# EAGLE design lemidi (EAGLE 7.5.0)
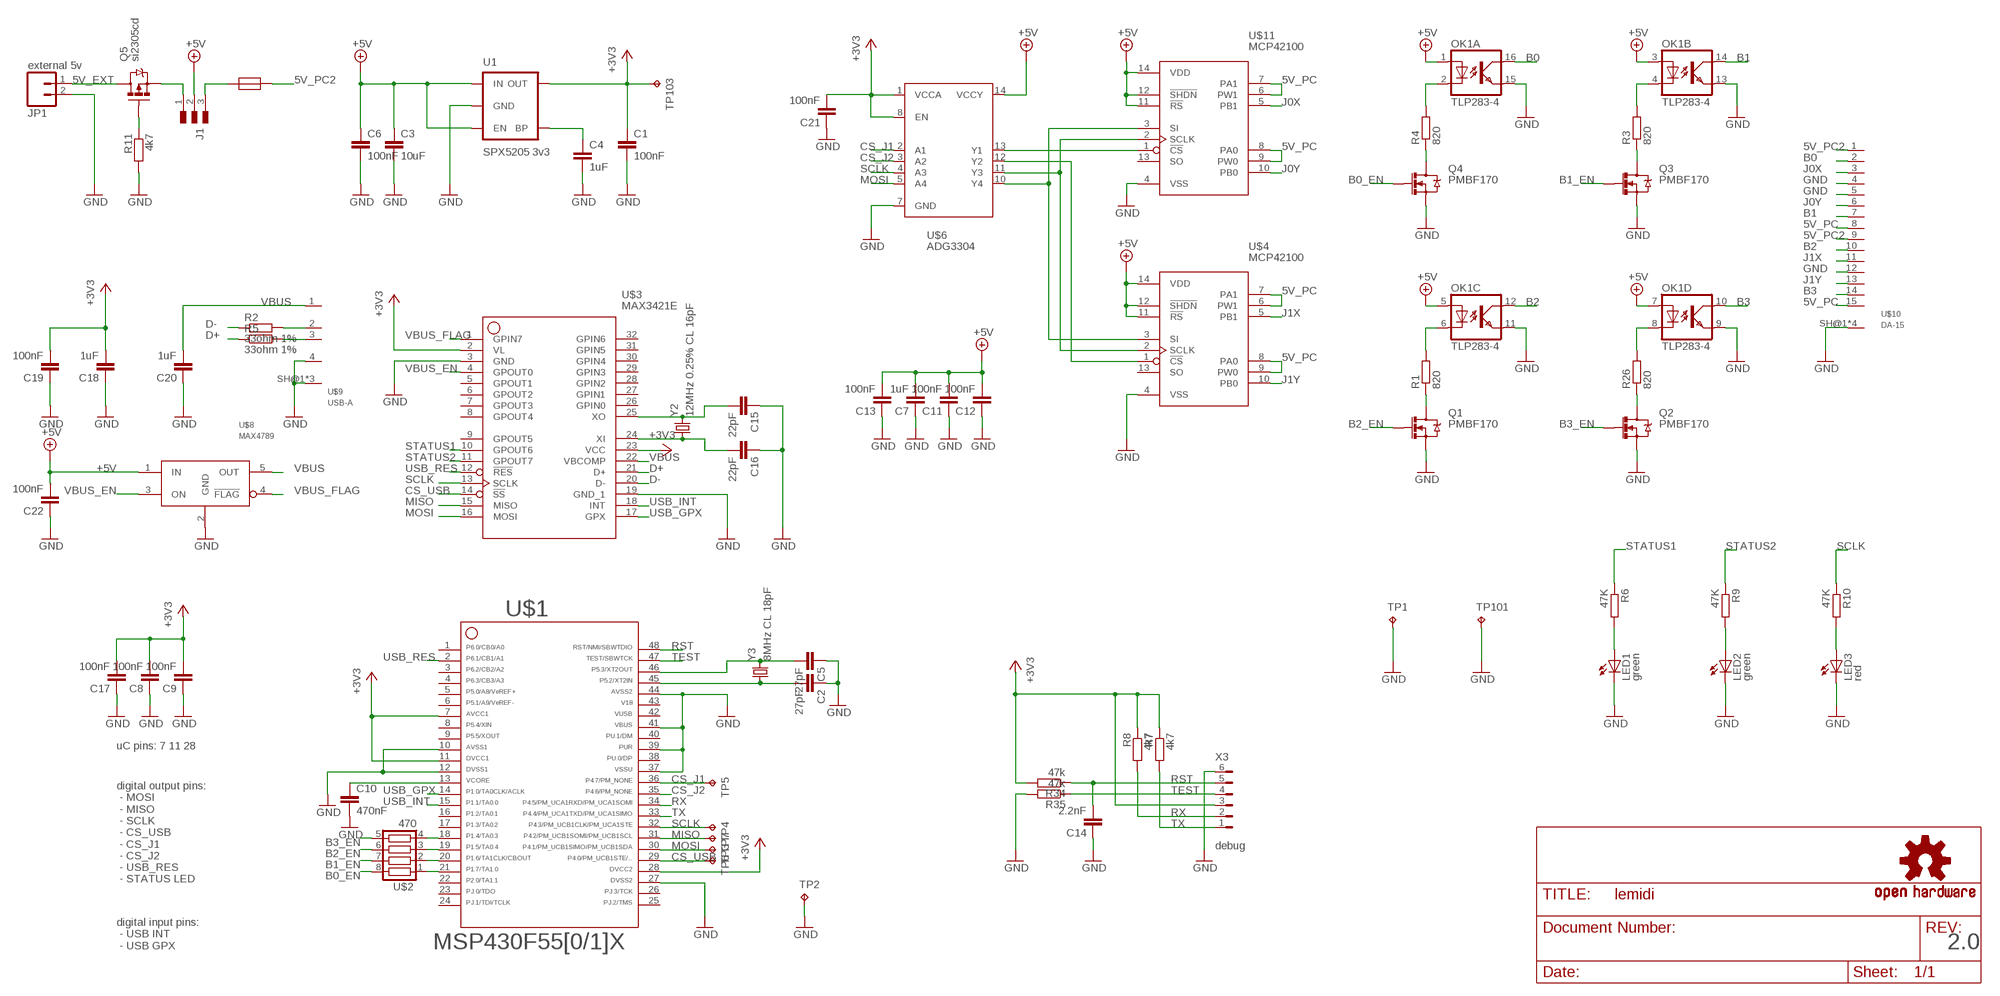
[diagram p0: schematic, sheet 1]

## Parts
C1  100nF  C-EUC0805  [C0805]
C2  27pF  C-EUC0805  [C0805]
C3  10uF  C-EUC0805  [C0805]
C4  1uF  C-EUC0805  [C0805]
C5  27pF  C-EUC0805  [C0805]
C6  100nF  C-EUC0805  [C0805]
C7  1uF  C-EUC0805  [C0805]
C8  100nF  C-EUC0805  [C0805]
C9  100nF  C-EUC0805  [C0805]
C10  470nF  C-EUC0805  [C0805]
C11  100nF  C-EUC0805  [C0805]
C12  100nF  C-EUC0805  [C0805]
C13  100nF  C-EUC0805  [C0805]
C14  2.2nF  C-EUC0805  [C0805]
C15  22pF  C-EUC0805  [C0805]
C16  22pF  C-EUC0805  [C0805]
C17  100nF  C-EUC0805  [C0805]
C18  1uF  C-EUC0805  [C0805]
C19  100nF  C-EUC0805  [C0805]
C20  1uF  C-EUC0805  [C0805]
C21  100nF  C-EUC0805  [C0805]
C22  100nF  C-EUC0805  [C0805]
J1  SJ_3P  [SJ_3P]
JP1  external 5v  M02PTH  [1X02]
LED1  green  LEDCHIPLED_0805  [CHIPLED_0805]
LED2  green  LEDCHIPLED_0805  [CHIPLED_0805]
LED3  red  LEDCHIPLED_0805  [CHIPLED_0805]
OK1  TLP283-4  [MINI-FLAT-16]
Q1  PMBF170  MOSFET-NCHANNEL_SOT23-3  [SOT23-3]
Q2  PMBF170  MOSFET-NCHANNEL_SOT23-3  [SOT23-3]
Q3  PMBF170  MOSFET-NCHANNEL_SOT23-3  [SOT23-3]
Q4  PMBF170  MOSFET-NCHANNEL_SOT23-3  [SOT23-3]
Q5  si2305cd  MOSFET-PCHANNELSMD_POWER  [SOT23-3_POWER]
R1  820  R-EU_R0805W  [R0805W]
R2  33ohm 1%  R-EU_R0805W  [R0805W]
R3  820  R-EU_R0805W  [R0805W]
R4  820  R-EU_R0805W  [R0805W]
R5  33ohm 1%  R-EU_R0805W  [R0805W]
R6  47K  R-EU_R0805W  [R0805W]
R7  4k7  R-EU_R0805W  [R0805W]
R8  4k7  R-EU_R0805W  [R0805W]
R9  47K  R-EU_R0805W  [R0805W]
R10  47K  R-EU_R0805W  [R0805W]
R11  4k7  R-EU_R0805W  [R0805W]
R26  820  R-EU_R0805W  [R0805W]
R34  47k  R-EU_R0805W  [R0805W]
R35  47k  R-EU_R0805W  [R0805W]
TP1  TPTP12R  [TP12R]
TP2  TPTP12R  [TP12R]
TP3  TPTP12R  [TP12R]
TP4  TPTP12R  [TP12R]
TP5  TPTP12R  [TP12R]
TP6  TPTP12R  [TP12R]
TP7  TPTP12R  [TP12R]
TP101  TPTP12R  [TP12R]
TP103  TPTP12R  [TP12R]
U1  SPX5205 3v3  V_REG_LDOSMD  [SOT23-5]
U$1  MSP430F5510  F55[0/1]X---PT48  [PT48]
U$2  470  RES_ARR  [YC164]
U$3  MAX3421E  [TQFP32]
U$4  MCP42100  MCP42XX  [SO-14]
U$6  ADG3304  [TSSOP14]
U$7  OSHW-LOGOM  [OSHW-LOGO-M]
U$8  MAX4789  [SOT23-5]
U$9  USB-A  UBA-4R-D14T-4D  [UBA-4R-D14T-4D]
U$10  DA-15  ADAM_TECH-DSUB_DA-15  [ADAM_TECH_D-SUB_15]
U$11  MCP42100  MCP42XX  [SO-14]
U$12  RESETTABLE_1210  [1210]
X3  debug  MOLEX_6HORIZONTAL  [0530480610]
Y2  12MHz 0.25% CL 16pF  CRYSTAL  [CRYSTAL-SMD-11.4X4.35]
Y3  8MHz CL 18pF  CRYSTAL  [CRYSTAL-SMD-11.4X4.35]

## Nets
5V_EXT: JP1.1 Q5.3(D)
5V_PC: U$4.6(PW1) U$4.7(PA1) U$4.8(PA0) U$4.9(PW0) U$10.8 U$10.15 U$11.6(PW1) U$11.7(PA1) U$11.8(PA0) U$11.9(PW0)
5V_PC2: U$10.1 U$10.9 U$12.P$2
12MHX_XI: C16.2 U$3.24(XI) Y2.1
12MHZ_XO: C15.2 U$3.25(XO) Y2.2
+3V3: C1.1 C8.2 C9.2 C17.2 C18.2 C19.2 C21.2 R7.1 R8.1 R34.2 TP103.TP U1.5(OUT) U$1.7 U$1.11 U$1.28 U$3.2(VL) U$3.23(VCC) U$6.1(VCCA) U$6.8(EN) X3.3
+5V: C3.1 C6.1 C7.2 C11.2 C12.2 C13.2 C22.2 J1.2 OK1.1(A:A) OK1.3(B:A) OK1.5(C:A) OK1.7(D:A) U1.1(IN) U1.3(EN) U$4.11(!RS) U$4.12(!SHDN) U$4.14(VDD) U$6.14(VCCY) U$8.1(IN) U$11.11(!RS) U$11.12(!SHDN) U$11.14(VDD)
B0: OK1.16(A:COL) U$10.2
B0_EN: Q4.1(G) U$2.8
B1: OK1.14(B:COL) U$10.7
B1_EN: Q3.1(G) U$2.7
B2: OK1.12(C:COL) U$10.10
B2_EN: Q1.1(G) U$2.6
B3: OK1.10(D:COL) U$10.14
B3_EN: Q2.1(G) U$2.5
CS_J1: TP5.TP U$1.36 U$6.2(A1)
CS_J2: U$1.35 U$6.3(A2)
CS_USB: TP6.TP U$1.29 U$3.14(!SS)
D+: R5.1 U$3.21(D+)
D-: R2.1 U$3.20(D-)
GND: C1.2 C2.1 C3.2 C4.2 C5.1 C6.2 C7.1 C8.1 C9.1 C10.2 C11.1 C12.1 C13.1 C14.1 C15.1 C16.1 C17.1 C18.1 C19.1 C20.1 C21.1 C22.1 JP1.2 LED1.C LED2.C LED3.C OK1.9(D:EMIT) OK1.11(C:EMIT) OK1.13(B:EMIT) OK1.15(A:EMIT) Q1.2(S) Q2.2(S) Q3.2(S) Q4.2(S) R11.2 R35.2 TP1.TP TP2.TP TP101.TP U1.2(GND) U$1.10 U$1.12 U$1.27 U$1.37 U$1.39 U$1.41 U$1.44 U$3.3(GND) U$3.19(GND_1) U$4.4(VSS) U$6.7(GND) U$8.2(GND) U$9.4 U$9.SH@1(SH) U$9.SH@2(SH) U$9.SH@3(SH) U$10.4 U$10.5 U$10.12 U$10.SH@1(SHIELD) U$10.SH@2(SHIELD) U$10.SH@3(SHIELD) U$10.SH@4(SHIELD) U$11.4(VSS) X3.6
HIGH_CS1: U$6.13(Y1) U$11.1(!CS)
HIGH_CS2: U$4.1(!CS) U$6.12(Y2)
HIGH_MOSI: U$4.3(SI) U$6.10(Y4) U$11.3(SI)
HIGH_SCLK: U$4.2(SCLK) U$6.11(Y3) U$11.2(SCLK)
J0X: U$10.3 U$11.5(PB1)
J0Y: U$10.6 U$11.10(PB0)
J1X: U$4.5(PB1) U$10.11
J1Y: U$4.10(PB0) U$10.13
MISO: TP7.TP U$1.31 U$3.15(MISO)
MOSI: TP3.TP U$1.30 U$3.16(MOSI) U$6.5(A4)
N$1: LED1.A R6.2
N$2: C4.1 U1.4(BP)
N$3: U$1.18 U$2.4
N$4: LED2.A R9.2
N$5: Q1.3(D) R1.1
N$6: C10.1 U$1.13
N$7: OK1.6(C:C) R1.2
N$8: U$1.19 U$2.3
N$9: OK1.8(D:C) R26.2
N$10: J1.3 U$12.P$1
N$11: LED3.A R10.2
N$12: Q3.3(D) R3.1
N$13: OK1.4(B:C) R3.2
N$14: Q4.3(D) R4.1
N$15: OK1.2(A:C) R4.2
N$16: R5.2 U$9.3
N$17: R2.2 U$9.2
N$20: U$1.20 U$2.2
N$21: U$1.21 U$2.1
N$22: Q2.3(D) R26.1
N$23: J1.1 Q5.2(S)
N$24: Q5.1(G) R11.1
RST: C14.2 R34.1 U$1.48 X3.5
RX: R8.2 U$1.34 X3.2
SCLK: R10.1 TP4.TP U$1.32 U$3.13(SCLK) U$6.4(A3)
STATUS1: R6.1 U$3.10(GPOUT6)
STATUS2: R9.1 U$3.11(GPOUT7)
TEST: R35.1 U$1.47 X3.4
TX: R7.2 U$1.33 X3.1
USB_GPX: U$1.14 U$3.17(GPX)
USB_INT: U$1.15 U$3.18(INT)
USB_RES: U$1.2 U$3.12(!RES)
VBUS: C20.2 U$3.22(VBCOMP) U$8.5(OUT) U$9.1
VBUS_EN: U$3.4(GPOUT0) U$8.3(ON)
VBUS_FLAG: U$3.1(GPIN7) U$8.4(!FLAG)
XT2IN: C2.2 U$1.45 Y3.1
XT2OUT: C5.2 U$1.46 Y3.2
Unconnected: U$1.1 U$1.3 U$1.4 U$1.5 U$1.6 U$1.8 U$1.9 U$1.16 U$1.17 U$1.22 U$1.23 U$1.24 U$1.25 U$1.26 U$1.38 U$1.40 U$3.5(GPOUT1) U$3.6(GPOUT2) U$3.7(GPOUT3) U$3.8(GPOUT4) U$3.9(GPOUT5) U$3.26(GPIN0) U$3.27(GPIN1) U$3.28(GPIN2) U$3.29(GPIN3) U$3.30(GPIN4) U$3.31(GPIN5) U$3.32(GPIN6) U$4.13(SO) U$11.13(SO)

## Notes on the sheet
- uC pins: 7 11 28
- digital output pins: 
   - MOSI
   - MISO
   - SCLK
   - CS_USB
   - CS_J1
   - CS_J2
   - USB_RES
   - STATUS LED
- digital input pins:
   - USB INT
   - USB GPX
- 2.0

## Power pins joined to a net without a drawn wire
42: U$1.42
43: U$1.43

## Library data of the parts
C1-C22 = rcl:C-EU: CAPACITOR, European symbol
J1 = Simplex-Jumpers:SJ_3P: solder jumper 3 pin
JP1 = SparkFun-Connectors:M02: Standard 2-pin 0.1" header. Use with - straight break away headers ( PRT-00116) - right angle break away headers (PRT-00553) - swiss pins (PRT-00743) - machine pins (PRT-00117) - female headers (PRT-00115) Molex polarized connector foot print use with: PRT-08233 with associated crimp pins and housings. 2.54_SCREWTERM for use with PRT-10571. 3.5mm Screw Terminal footprints for PRT-08084 5mm Screw Terminal footprints for use with PRT-08432
LED1-LED3 = led:LED: LED OSRAM: - CHIPLED LG R971, LG N971, LY N971, LG Q971, LY Q971, LO R971, LY R971 LH N974, LH R974 LS Q976, LO Q976, LY Q976 LO Q996 - Hyper CHIPLED LW Q18S LB Q993, LB Q99A, LB R99A - SideLED LS A670, LO A670, LY A670, LG A670, LP A670 LB A673, LV A673, LT A673, LW A673 LH A674 LY A675 LS A676, LA A676, LO A676, LY A676, LW A676 LS A679, LY A679, LG A679 - Hyper Micro SIDELED® LS Y876, LA Y876, LO Y876, LY Y876 LT Y87S - SmartLED LW L88C, LW L88S LB L89C, LB L89S, LG L890 LS L89K, LO L89K, LY L89K LS L896, LA L896, LO L896, LY L896 - TOPLED LS T670, LO T670, LY T670, LG T670, LP T670 LSG T670, LSP T670, LSY T670, LOP T670, LYG T670 LG T671, LOG T671, LSG T671 LB T673, LV T673, LT T673, LW T673 LH T674 LS T676, LA T676, LO T676, LY T676, LB T676, LH T676, LSB T676, LW T676 LB T67C, LV T67C, LT T67C, LS T67K, LO T67K, LY T67K, LW E67C LS E67B, LA E67B, LO E67B, LY E67B, LB E67C, LV E67C, LT E67C LW T67C LS T679, LY T679, LG T679 LS T770, LO T770, LY T770, LG T770, LP T770 LB T773, LV T773, LT T773, LW T773 LH T774 LS E675, LA E675, LY E675, LS T675 LS T776, LA T776, LO T776, LY T776, LB T776 LHGB T686 LT T68C, LB T68C - Hyper Mini TOPLED® LB M676 - Mini TOPLED Santana® LG M470 LS M47K, LO M47K, LY M47K Source: http://www.osram.convergy.de LUXEON: - LUMILED® LXK2-PW12-R00, LXK2-PW12-S00, LXK2-PW14-U00, LXK2-PW14-V00 LXK2-PM12-R00, LXK2-PM12-S00, LXK2-PM14-U00 LXK2-PE12-Q00, LXK2-PE12-R00, LXK2-PE12-S00, LXK2-PE14-T00, LXK2-PE14-U00 LXK2-PB12-K00, LXK2-PB12-L00, LXK2-PB12-M00, LXK2-PB14-N00, LXK2-PB14-P00, LXK2-PB14-Q00 LXK2-PR12-L00, LXK2-PR12-M00, LXK2-PR14-Q00, LXK2-PR14-R00 LXK2-PD12-Q00, LXK2-PD12-R00, LXK2-PD12-S00 LXK2-PH12-R00, LXK2-PH12-S00 LXK2-PL12-P00, LXK2-PL12-Q00, LXK2-PL12-R00 Source: www.luxeon.com KINGBRIGHT: KA-3528ASYC Source: www.kingbright.com
OK1 = optocoupler:TLP283-4: TOSHIBA PHOTOCOUPLER GaAs IRED & PHOTO-TRANSISTOR Source: http://www.semicon.toshiba.co.jp/td/en/Opto/Photocoupler/en_20050928_TLP283_datasheet.pdf; OC_FARNELL: unknown; OC_NEWARK: unknown
Q1-Q4 = Simplex-DiscreteSemi:MOSFET-NCHANNEL: Generic N-channel mosfet
Q5 = Simplex-DiscreteSemi:MOSFET-PCHANNEL: Generic PMOSFET
R1-R11 R26 R34 R35 = rcl:R-EU_: RESISTOR, European symbol
TP1-TP7 TP101 TP103 = testpad:TP: Test pad
U1 = SparkFun:V_REG_LDO: Voltage Regulator LDO Standard 150mA LDO voltage regulator in SOT-23 layout. Micrel part MIC5205. BP (by-pass) pin is used to lower output noise with 470pF cap.
U$1 = TI_MSP430_v16:F55[0/1]X---PT48: ***F55[0/1/2]X*** PT48 Rev. 1.0 06/2010 "http://www.ti.com/lit/gpn/msp430f5509" Only for FF5504, F5508,F5509,F5510
U$2 = Simplex-rlc:RES_ARR: resistor chip array yageo YC164 series (8pin/4R)
U$3 = Simplex-ICs:MAX3421E: MAX3421E USB Periperal/Host Controller
U$4 U$11 = Simplex-ICs:MCP42XX: MCP42xx dual digital potentiometer
U$6 = Simplex-ICs:ADG3304: ADG3304 4channel bi-directional voltage level translator
U$7 = SparkFun:OSHW-LOGO: Open Source Hardware Logo This logo indicates the piece of hardware it is found on incorporates a OSHW license and/or adheres to the definition of open source hardware found here: http://freedomdefined.org/OSHW
U$8 = Simplex-ICs:MAX4789: MAX4789 - MAX4794 current limit switch
U$9 = Simplex-Connectors:UBA-4R-D14T-4D: JST USB A
U$10 = Simplex-Connectors:ADAM_TECH-DSUB_DA-15: ADAM TECH D-SUB DA-15
U$12 = Simplex-Fuses:RESETTABLE: resettable fuse
X3 = Simplex-Connectors:MOLEX_6: Molex 6 pin connectors 1.25mm PicoBlade
Y2 Y3 = Simplex-FreqCtrl:CRYSTAL: smd crystals

## Net classes
1 vcc: width 0.203 mm

## Board
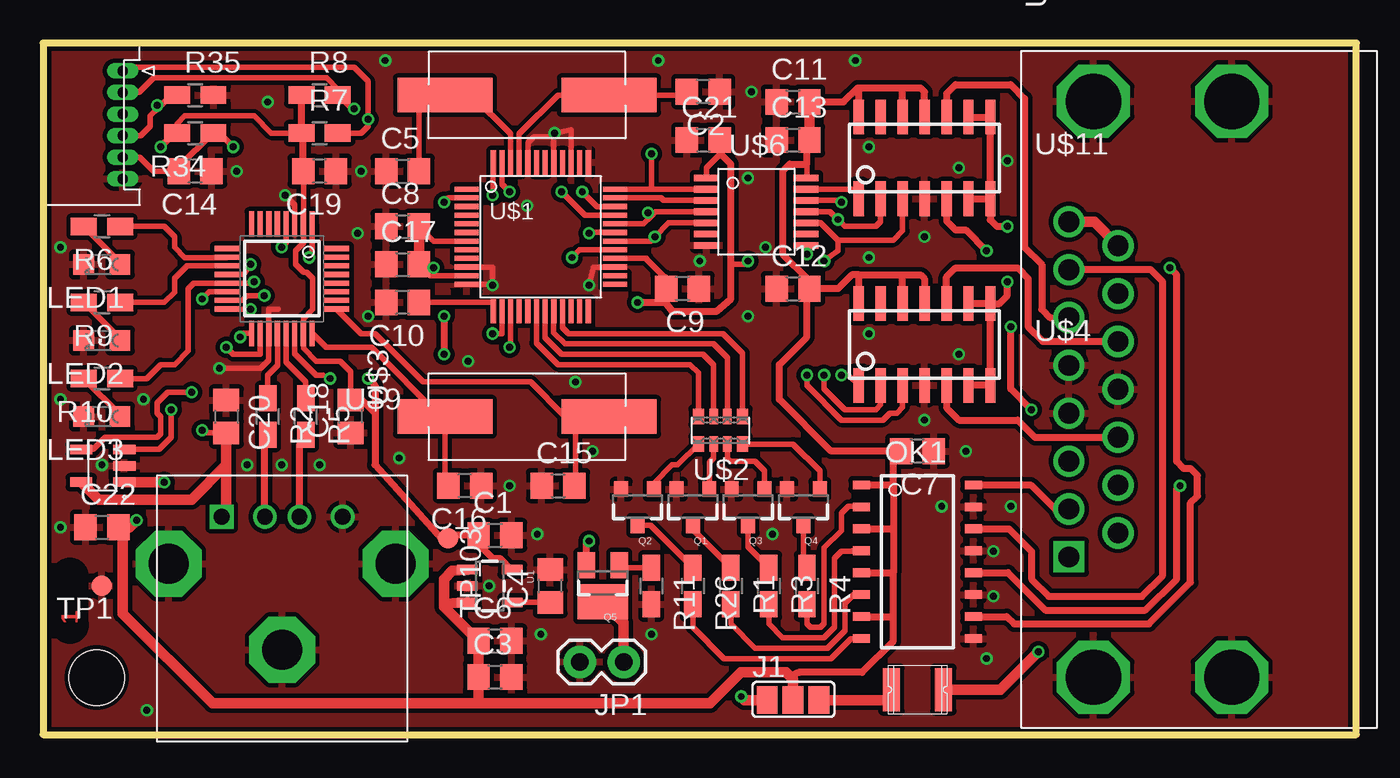
[diagram p1: board, top side]
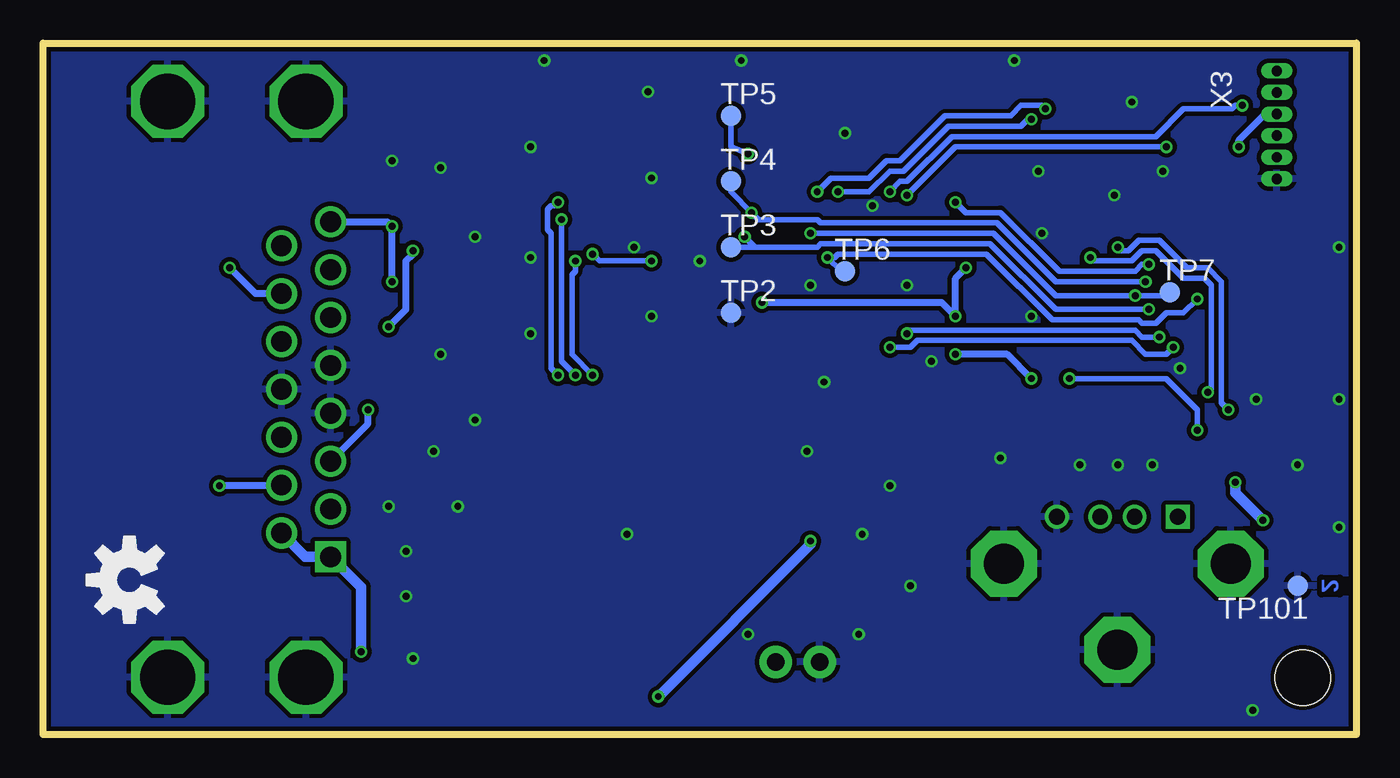
[diagram p2: board, bottom side, seen from below]

Size 76 x 40 mm. Coordinates in mm from the lower left corner, seen from the top.
Outline: 0,0 76,0 76,40 0,40 0,0
Copper layers (1*16): Top 0.035mm / dielectric 1.5mm / Bottom 0.035mm
Design rules "seeed_2-layer_20140221": minimum track width 6mil, minimum drill 12mil, track to track 6mil, track to pad 6mil, pad to pad 6mil, via to via 6mil, smd to smd 0mil, copper to edge 10mil, drill to drill 10mil, minimum pad ring 6mil, minimum via ring 6mil, stop-mask expansion 2mil, vias tented up to drill 100mil, thermal gap 10mil
Holes 3.2 mm at 3.1,3.3
tRestrict: 1 lines

### Footprints (pad centres in the part's own frame; a part is rotated, then mirrored left to right if it is on the bottom)
C0805 = smd 1.3 x 1.5: 1 -0.95,0; 2 0.95,0
SJ_3P = smd 1.2 x 1.6: 1 0,0; 2 1.5,0; 3 3,0
1X02 = drill 1.016 pad 1.88: 1 0,0; 2 2.54,0
CHIPLED_0805 = smd 1.2 x 1.2: A 0,-1.05; C 0,1.05
MINI-FLAT-16 = smd 1 x 0.5: 1 -3.24,4.445; 2 -3.24,3.175; 3 -3.24,1.905; 4 -3.24,0.635; 5 -3.24,-0.635; 6 -3.24,-1.905; 7 -3.24,-3.175; 8 -3.24,-4.445; 9 3.24,-4.445; 10 3.24,-3.175; 11 3.24,-1.905; 12 3.24,-0.635; 13 3.24,0.635; 14 3.24,1.905; 15 3.24,3.175; 16 3.24,4.445
SOT23-3 = smd 0.8 x 0.9: 1 -0.95,-1; 2 0.95,-1; 3 0,1.1
SOT23-3_POWER = smd 1 x 1.5: 1 -0.939,-1.384; 2 0.961,-1.384 | smd 2.9 x 2.05: 3 0.011,0.716
R0805W = smd 1.5 x 1: 1 -1.052,0; 2 1.052,0
TP12R = smd 1.2 x 1.2: TP 0,0
SOT23-5 = smd 0.55 x 1.2: 1 -0.95,-1.3; 2 0,-1.3; 3 0.95,-1.3; 4 0.95,1.3; 5 -0.95,1.3
PT48 = smd 1.4 x 0.3: 1 -4.3,2.75; 2 -4.3,2.25; 3 -4.3,1.75; 4 -4.3,1.25; 5 -4.3,0.75; 6 -4.3,0.25; 7 -4.3,-0.25; 8 -4.3,-0.75; 9 -4.3,-1.25; 10 -4.3,-1.75; 11 -4.3,-2.25; 12 -4.3,-2.75; 25 4.3,-2.75; 26 4.3,-2.25; 27 4.3,-1.75; 28 4.3,-1.25; 29 4.3,-0.75; 30 4.3,-0.25; 31 4.3,0.25; 32 4.3,0.75; 33 4.3,1.25; 34 4.3,1.75; 35 4.3,2.25; 36 4.3,2.75 | smd 0.3 x 1.4: 13 -2.75,-4.3; 14 -2.25,-4.3; 15 -1.75,-4.3; 16 -1.25,-4.3; 17 -0.75,-4.3; 18 -0.25,-4.3; 19 0.25,-4.3; 20 0.75,-4.3; 21 1.25,-4.3; 22 1.75,-4.3; 23 2.25,-4.3; 24 2.75,-4.3; 37 2.75,4.3; 38 2.25,4.3; 39 1.75,4.3; 40 1.25,4.3; 41 0.75,4.3; 42 0.25,4.3; 43 -0.25,4.3; 44 -0.75,4.3; 45 -1.25,4.3; 46 -1.75,4.3; 47 -2.25,4.3; 48 -2.75,4.3
YC164 = smd 0.65 x 0.9: 1 -1.275,-0.8; 4 1.275,-0.8; 5 1.275,0.8; 8 -1.275,0.8 | smd 0.5 x 0.9: 2 -0.4,-0.8; 3 0.4,-0.8; 6 0.4,0.8; 7 -0.4,0.8
TQFP32 = smd 1.475 x 0.3: 1 0,0; 2 0,-0.5; 3 0,-1; 4 0,-1.5; 5 0,-2; 6 0,-2.5; 7 0,-3; 8 0,-3.5; 17 6.32,-3.5; 18 6.32,-3; 19 6.32,-2.5; 20 6.32,-2; 21 6.32,-1.5; 22 6.32,-1; 23 6.32,-0.5; 24 6.32,0 | smd 0.3 x 1.475: 9 1.41,-4.91; 10 1.91,-4.91; 11 2.41,-4.91; 12 2.91,-4.91; 13 3.41,-4.91; 14 3.91,-4.91; 15 4.41,-4.91; 16 4.91,-4.91; 25 4.91,1.41; 26 4.41,1.41; 27 3.91,1.41; 28 3.41,1.41; 29 2.91,1.41; 30 2.41,1.41; 31 1.91,1.41; 32 1.41,1.41
SO-14 = smd 0.6 x 2: 1 0,0; 2 1.27,0; 3 2.54,0; 4 3.81,0; 5 5.08,0; 6 6.35,0; 7 7.62,0; 8 7.62,4.73; 9 6.35,4.73; 10 5.08,4.73; 11 3.81,4.73; 12 2.54,4.73; 13 1.27,4.73; 14 0,4.73
TSSOP14 = smd 1.45 x 0.38: 1 0,0; 2 0,-0.65; 3 0,-1.3; 4 0,-1.95; 5 0,-2.6; 6 0,-3.25; 7 0,-3.9; 8 5.75,-3.9; 9 5.75,-3.25; 10 5.75,-2.6; 11 5.75,-1.95; 12 5.75,-1.3; 13 5.75,-0.65; 14 5.75,0
SOT23-5' = smd 1.3 x 0.55: 1 0,0; 2 0,-0.95; 3 0,-1.9; 4 2.5,-1.9; 5 2.5,0
UBA-4R-D14T-4D = drill 0.92 square: 1 3.07,2.71 | drill 0.92: 2 5.57,2.71; 3 7.57,2.71; 4 10.07,2.71 | drill 2.3 pad 3.81 octagon: SH@1 0,0; SH@2 6.57,-4.98; SH@3 13.14,0
ADAM_TECH_D-SUB_15 = drill 1.2 square: 1 0,0 | drill 1.2: 2 2.77,0; 3 5.54,0; 4 8.31,0; 5 11.08,0; 6 13.85,0; 7 16.62,0; 8 19.39,0; 9 1.385,-2.84; 10 4.155,-2.84; 11 6.925,-2.84; 12 9.695,-2.84; 13 12.465,-2.84; 14 15.235,-2.84; 15 18.005,-2.84 | drill 3.2 octagon: SH@1 -6.965,-1.42; SH@2 26.355,-1.42; SH@3 -6.965,-9.42; SH@4 26.355,-9.42
1210 = smd 1 x 2.5: P$1 -1.5,0; P$2 1.5,0
0530480610 = drill 0.6 pad 0.9 long: 1 0,0; 2 1.25,0; 3 2.5,0; 4 3.75,0; 5 5,0; 6 6.25,0
CRYSTAL-SMD-11.4X4.35 = smd 5.5 x 2: 1 -4.75,0; 2 4.75,0

### Placement (x,y rotation side)
C1  26.15,11.53 0 top
C2  38.2,37.2 180 top
C3  26.15,3.33 0 top
C4  29.35,8.6 90 top
C5  20.8,32.6 0 top
C6  26.15,5.43 0 top
C7  50.6,16.4 180 top
C8  20.8,29.4 0 top
C9  37,25.8 180 top
C10  20.8,25 180 top
C11  43.4,36.6 0 top
C12  43.4,25.8 0 top
C13  43.4,34.4 0 top
C14  8.8,32.6 180 top
C15  29.8,14.4 0 top
C16  24.4,14.4 180 top
C17  20.8,27.2 0 top
C18  17.8,18.4 90 top
C19  16,32.6 180 top
C20  10.6,18.4 270 top
C21  38.2,34.4 0 top
C22  3.4,12 0 top
J1  41.9,2 0 top
JP1  33.6,4.2 180 top
LED1  3.4,27.2 90 top
LED2  3.4,22.8 90 top
LED3  3.4,18.4 90 top
OK1  50.6,10 0 top
Q1  37.6,13.2 180 top
Q2  34.4,13.2 180 top
Q3  40.8,13.2 180 top
Q4  44,13.2 180 top
Q5  32.4,8.4 180 top
R1  39.8,8.6 270 top
R2  13,18.4 270 top
R3  42,8.6 270 top
R4  44.2,8.6 270 top
R5  15.2,18.4 270 top
R6  3.4,29.4 180 top
R7  16,34.8 0 top
R8  16,37 0 top
R9  3.4,25 180 top
R10  3.4,20.6 180 top
R11  35.2,8.6 270 top
R26  37.6,8.6 270 top
R34  8.8,34.8 180 top
R35  8.8,37 0 top
TP1  3.4,8.6 180 top
TP2  36.2,24.4 0 bottom
TP3  36.2,28.2 0 bottom
TP4  36.2,32 0 bottom
TP5  36.2,35.8 0 bottom
TP6  29.6,26.8 0 bottom
TP7  10.8,25.6 0 bottom
TP101  3.4,8.6 180 bottom
TP103  23.44,11.36 270 top
U1  25.85,8.6 270 top
U$1  28.8,28.8 0 top
U$2  39.2,17.6 180 top
U$3  15.56,29.53 270 top
U$4  47.2,20.2 0 top
U$6  38.4,32.2 0 top
U$7  71.01,8.95 90 bottom
U$8  MAX4789  [SOT23-5']  4.7,14.6 180 top
U$9  7.26,9.89 0 top
U$10  59.37,10.28 90 top
U$11  47.2,31 0 top
U$12  50.6,2.6 0 top
X3  4.6,38.4 270 top
Y2  28,18.4 0 top
Y3  28,37 180 top

### Tracks (layer width: path | path; a pad name or v marks a point on that pad's centre or on a via)
5V_EXT
  Top 0.61: JP1.1 33.6,6.47 Q5.3
5V_PC  (via drill 0.4)
  Top 0.406: U$11.9 U$11.8 U$11.7 | U$11.6 U$11.7 | U$11.7 54.82,29.78 55.2,29.4 v55.8,29.4 | U$4.8 55.33,24.93 55.8,25.4 v55.8,26.2 | U$4.8 U$4.9 | U$4.8 U$4.7 U$4.6
  Top 0.61: U$10.15 60.83,29.67 U$10.8
  Bottom 0.406: U$10.8 56.07,29.67 v55.8,29.4 v55.8,26.2
5V_PC2  (via drill 0.4)
  Top 0.61: v57.6,4.8 55.4,2.6 U$12.P$2
  Bottom 0.61: v57.6,4.8 57.6,8.51 U$10.1 60.83,10.28 U$10.9
12MHX_XI
  Top 0.305: U$3.24 16.37,22.4 19,22.4 23,18.4 Y2.1 23.25,14.6 C16.2
12MHZ_XO
  Top 0.305: U$3.25 18.39,23.2 19.2,23.2 22,20.4 28.2,20.4 30.2,18.4 30.8,18.4 | 30.8,18.4 Y2.2 | C15.2 30.8,14.65 30.8,18.4
+3V3  (via drill 0.4)
  Top 0.305: C18.2 17.8,21 17.2,21.6 15.8,21.6 15.06,22.34 U$3.23 15.06,24.06 15.6,24.6 15.6,26.4 15.26,26.74 15.06,26.74 14.6,27.2 14.6,28 15.06,28.46 U$3.2 C19.2 15.05,32.8 | C8.2 22.6,28.55 U$1.7 | 21.95,27 22.4,26.55 U$1.11 | R34.2 7.75,35.35 8.2,35.8 12.2,35.8 13.2,34.8 R7.1 | 26.43,10.2 26.5,10.2 U1.5 | U$6.1 38.4,32.8 39.15,33.55 C21.2 | 36,26.44 34.93,27.51 arc90 34.89,27.55 U$1.28 | 39.8,27.2 40.6,27.2 v40.8,27.4 | U$6.8 44.15,27.85 v44.2,27.8
  Top 0.406: 26.43,10.2 26,10.2 25.2,11 C1.1 23.67,11.53 TP103.TP 23.04,11.36 19.2,15.6 19.2,18.6 | C18.2 18.45,19.35 19.2,18.6 | 19.2,18.6 19.2,20.2 v18.8,20.6 | v22.6,27 21.95,27 C17.2 | v23.2,24.2 v23.2,22 | C9.2 36,26.44 36,25 | 15.05,32.8 15.05,34.7 R7.1 R8.1 | R34.2 7.6,34.8 v6.8,34 | v34.4,25 36,25 | 36,25 36.4,24.5 39,24.5 39.8,25.2 39.8,27.2 39.8,33 39.15,33.65 C21.2
  Top 0.61: C17.2 C8.2
  Bottom 0.305: v40.8,27.4 43.8,27.4 v44.2,27.8
  Bottom 0.406: v18.8,20.6 20.2,22 v23.2,22 | v34.4,25 24,25 v23.2,24.2 23.2,26.4 v22.6,27 | v6.8,34 6.8,34.4 5.3,35.9 X3.3
+5V  (via drill 0.4)
  Top 0.305: U$6.14 44.2,32.2 44.2,33
  Top 0.406: OK1.7 49.2,6.83 | OK1.5 49.2,9.37 | OK1.3 49.2,11.9 | 49.2,11.9 49.2,9.37 | OK1.1 49.2,14.45 | 49.2,14.45 49.2,11.9 | 49.2,6.83 49.2,5.4 47.4,3.6 43.8,3.6 arc90 43.4,3.2 | 49.2,6.83 49.2,9.37 | C13.2 44.2,34.25 44.2,33 43.2,33 42.8,32.6 42.8,27.8 44.2,26.4 44.2,25.95 C12.2 | 49.2,14.45 49.2,15.95 C7.2 45.6,16.4 42.6,19.4 42.6,21.4 44.2,23 44.2,25.65 arc-90 C12.2 | 44.35,25.85 C12.2 | 49.8,26.6 50.8,26.6 51,26.4 U$4.11 | U$4.12 49.74,26.54 49.8,26.6 | C11.2 46.33,36.6 47.13,37.4 47.2,37.4 | U$11.11 51.01,37.19 50.8,37.4 49.8,37.4 | 49.8,37.4 47.2,37.4 | U$11.12 49.74,37.34 49.8,37.4 | U$11.14 47.2,37.4 | 47.2,26.6 49.8,26.6 | U$4.14 47.2,26.6 | 47.2,26.6 46.8,26.6 46,25.8 C12.2
  Top 0.61: 43.3,2.3 J1.2 43.4,3.2 43,3.6 40.4,3.6 38.6,1.8 25.2,1.8 | U1.1 23.68,9.48 23.2,9 23.2,7.58 | 23.2,7.58 23.2,7.4 25.17,5.43 C6.1 C3.1 25.2,1.8 | U1.3 23.2,7.58 | 25.2,1.8 9.8,1.8 4.6,7 4.6,12 C22.2 5,12 v5.4,12.4 | U$8.1 v7,14.6 | C13.2 C11.2
  Bottom 0.61: v7,14.6 7,14 v5.4,12.4
B0
  Top 0.406: OK1.16 57.16,14.45 58.6,13 59.32,13 U$10.2
B0_EN
  Top 0.305: U$2.8 43.4,16.8 44.95,15.25 Q4.1
B1
  Top 0.406: OK1.14 55.9,11.9 57.2,10.6 57.2,9 58.2,8 63.6,8 64.8,9.2 64.8,26.2 64.1,26.9 U$10.7
B1_EN
  Top 0.305: U$2.7 39.6,16 39.8,15.8 41.2,15.8 41.75,15.25 Q3.1
B2  (via drill 0.4)
  Top 0.406: OK1.12 55.84,9.37 58,7.2 63.8,7.2 65.6,9 65.6,14.2 v65.8,14.4
  Bottom 0.406: U$10.10 62.24,14.4 v65.8,14.4
B2_EN
  Top 0.305: U$2.6 38.8,16 38.55,15.75 Q1.1
B3  (via drill 0.4)
  Top 0.406: OK1.10 55.77,6.83 56.2,6.4 64,6.4 66.4,8.8 66.4,13.4 66.8,13.8 66.8,15 66.4,15.4 66,15.4 65.6,15.8 65.6,26.6 v65.2,27
  Bottom 0.406: U$10.14 63.72,25.52 v65.2,27
B3_EN
  Top 0.305: Q2.1 35.35,14.55 36.4,15.6 36.73,15.6 U$2.5
CS_J1  (via drill 0.4)
  Top 0.305: U$1.36 35.2,31.55 | 35.2,31.55 U$6.2 | v35.2,33.6 35.2,31.55
  Bottom 0.305: v35.2,33.6 36.2,34 TP5.TP
CS_J2
  Top 0.305: U$1.35 35.75,31.05 35.9,30.9 U$6.3
CS_USB  (via drill 0.4)
  Top 0.305: U$1.29 31.05,28.05 v30.6,27.6 | U$3.14 9.62,25.62 v9.2,25.2
  Bottom 0.305: TP6.TP 29.8,26.8 v30.6,27.6 30.2,27.6 30,27.8 21.4,27.8 17.6,24 12.6,24 12.4,23.8 11.6,23.8 11,24.4 10,24.4 v9.2,25.2
D+
  Top 0.305: U$3.21 14.06,21.54 15.2,20.4 R5.1
D-
  Top 0.305: U$3.20 13.56,21.36 13,20.8 R2.1
GND  (via drill 0.4)
  Top 0.305: U$1.27 31.85,27.05 v31.6,26 | U$1.12 26.15,26.05 v26,26 26,27.05 U$1.10 | U$1.41 29.55,35 v29.6,34.8 | U$1.39 30.55,35 v29.6,34.8 | U$1.44 28.05,34.25 28.4,34.6 29.4,34.6 v29.6,34.8 | U$3.3 14.56,30.64 v14,31.2 | v10.2,21.2 12.6,21.2 13.06,21.66 U$3.19 13.06,24.6 13.6,24.6
  other vias: 18.2,29 25.8,8.6 3.4,15.6 24.6,21.6 30.8,20.4 31.8,16.4 20.6,16 11.8,15.6 16,15.6 13.8,15.6 38,27.4 5.8,19.4 13,36.6 54.6,4.4 55,8 55,10.6 56,13.2 42.2,11.6 19.8,39 35.6,39 41,37.2 55.8,33.2 1,12 1,28.2 1,19.4 28.6,11.6 28.8,5.8 35.2,5.8 28,30.6 47.8,34 53,32.8 47.8,27.6 51,28.8 47.8,23.2 53,22 53.4,16.4 51,18.2 52,13.2 40.8,32.2 41.8,28.2 11.2,32.6 6,1.4 47,39 40.8,24.2 27,14.4 18.4,32.6 18.8,24.2
  pour Top (isolate 0.254): 0,40 76,40 76,0 0,0
  pour Bottom (isolate 0.254): 0,40 76,40 76,0 0,0
HIGH_CS1
  Top 0.305: U$6.13 47.2,31.55 U$11.1
HIGH_CS2  (via drill 0.4)
  Top 0.305: U$6.12 46.1,30.9 arc-90 v46.2,30.8 | U$4.1 46.6,20.8 v46.2,20.8
  Bottom 0.305: v46.2,20.8 46.6,21.2 46.6,29 46.8,29.2 46.8,30.4 46.6,30.6 46.4,30.6 v46.2,30.8
HIGH_MOSI  (via drill 0.4)
  Top 0.305: U$6.10 45,29.6 46,28.6 | 46,28.6 49.2,28.6 49.74,29.14 U$11.3 | v44.2,20.8 44.2,20.2 46.2,18.2 48.6,18.2 49,18.6 49.4,18.6 49.74,18.94 U$4.3 | v45.2,27.4 46,28 46,28.6
  Bottom 0.305: v45.2,27.4 45.2,26.8 45.4,26.6 45.4,22 v44.2,20.8
HIGH_SCLK  (via drill 0.4)
  Top 0.305: U$11.2 48.47,29.67 48.2,29.4 46.4,29.4 v46,29.8 45.55,30.25 U$6.11 | v45.2,20.8 45.2,20 46.4,18.8 48.2,18.8 48.47,19.07 U$4.2
  Bottom 0.305: v45.2,20.8 46,21.6 46,29.6 45.9,29.7 | 45.9,29.7 v46,29.8 | 45.9,29.7 45.9,29.9
J0X  (via drill 0.4)
  Top 0.406: v57.2,18.8 56,20 v56,23.6 | U$11.5 52.28,29.72 52.8,29.2 53.4,29.2 v54.6,28
  Bottom 0.406: U$10.3 57.2,17.99 v57.2,18.8 | v56,23.6 55,24.6 55,27.4 54.6,27.8 v54.6,28
J0Y
  Top 0.406: U$10.6 58.27,24.13 57.8,24.6 57.8,27.2 56.8,28.2 56.8,36.8 56,37.6 52.8,37.6 52.28,37.08 U$11.10
J1X
  Top 0.406: U$4.5 52.28,18.92 53,18.2 56.4,18.2 57.4,17.2 U$10.11
J1Y
  Top 0.406: U$4.10 52.28,26.48 52.8,27 56.4,27 57,26.4 57,23.6 57.85,22.75 U$10.13
MISO  (via drill 0.4)
  Top 0.305: U$1.31 31.65,29.05 v31.6,29 | U$3.15 11.52,25.12 11.8,25.4 v12.8,25.4
  Bottom 0.305: v31.6,29 21,29 17.4,25.4 v12.8,25.4 11,25.4 TP7.TP
MOSI  (via drill 0.4)
  Top 0.305: U$1.30 35.15,28.55 v35.4,28.8 36.2,29.6 U$6.5 | U$3.16 11.98,24.62 v12,24.6
  Bottom 0.305: v35.4,28.8 34.8,28.2 | 34.8,28.2 31.2,28.2 31,28.4 21.2,28.4 17.4,24.6 v12,24.6 | TP3.TP 34.8,28.2
N$1
  Top 0.305: R6.2 4.45,27.3 LED1.A
N$2
  Top 0.305: U1.4 C4.1
N$3
  Top 0.305: U$1.18 28.55,22.65 29.8,21.4 37.45,21.4 37.92,20.93 U$2.4
N$4
  Top 0.305: R9.2 4.45,22.9 LED2.A
N$5
  Top 0.305: Q1.3 37.6,11.85 R1.1
N$6
  Top 0.305: U$1.13 26.05,25 C10.1
N$7
  Top 0.305: R1.2 39.8,6.4 41.2,5 45.4,5 46.4,6 46.4,7.6 46.9,8.1 OK1.6
N$8
  Top 0.305: U$1.19 29.05,22.95 30,22 38.2,22 38.8,21.4 U$2.3
N$9
  Top 0.305: 47.31,5.6 OK1.8 46.76,5.55 45.6,4.4 39.4,4.4 37.6,6.2 R26.2
N$10
  Top 0.61: 48.9,2.2 U$12.P$1 49.1,2 J1.3
N$11
  Top 0.305: R10.2 4.45,18.5 LED3.A
N$12
  Top 0.305: Q3.3 40.8,10.85 R3.1
N$13
  Top 0.305: 47.33,10.6 OK1.4 46.84,10.63 46.8,10.6 46.2,10.6 45.8,10.2 45.8,6.2 45.2,5.6 42.8,5.6 42,6.4 R3.2
N$14
  Top 0.305: Q4.3 44,9.85 R4.1
N$15
  Top 0.305: R4.2 44.2,6.4 44.4,6.2 45,6.2 45.2,6.4 45.2,10.8 46.2,11.8 46.2,12.8 46.6,13.2 47.34,13.2 OK1.2
N$16
  Top 0.406: U$9.3 14.83,16.78 R5.2
N$17
  Top 0.406: U$9.2 12.83,17.12 R2.2
N$20
  Top 0.305: U$1.20 29.55,23.25 30.2,22.6 38.8,22.6 39.6,21.8 U$2.2
N$21
  Top 0.305: U$1.21 30.05,23.55 30.4,23.2 39.35,23.2 40.48,22.07 U$2.1
N$22
  Top 0.305: Q2.3 35.15,12.1 R26.1
N$23  (via drill 0.4)
  Top 0.406: Q5.2 31.44,11.04 arc-90 v31.6,11.2
  Top 0.61: 31.64,11.16 v31.6,11.2 | v40.4,2.2 40.6,2 J1.1
  Bottom 0.61: v31.6,11.2 31.6,11 v40.4,2.2
N$24
  Top 0.305: Q5.1 33.67,9.65 R11.1
RST  (via drill 0.4)
  Top 0.305: 7.65,32.8 arc-90 C14.2 | C14.2 7.85,32.85 9.8,34.8 R34.1 10.2,34.8 v11,34 | U$1.48 26.05,31.2 v26,31.2 | X3.5 5.6,33.4 6.4,32.6 C14.2
  Bottom 0.305: v26,31.2 23.2,34 v11,34
RX  (via drill 0.4)
  Top 0.305: 4.95,37.15 X3.2 5.55,37.15 6.4,38 16.4,38 17.05,37.35 R8.2 17.85,36.2 v18,36.2 | U$1.34 32.05,30.55 v31.2,31.4
  Bottom 0.305: v31.2,31.4 30.4,32.2 28.2,32.2 27.2,33.2 26.4,33.2 23.8,35.8 20,35.8 19.4,36.4 18.2,36.4 v18,36.2
SCLK  (via drill 0.4)
  Top 0.305: U$1.32 34.75,29.55 35.2,30 | v12.2,26.2 12.12,26.12 U$3.13 8.72,26.12 8.4,25.8 8.4,22.2 7.6,21.4 6.8,21.4 6,20.6 R10.1 | U$6.4 35.45,30.25 35.2,30 | v35,30.2 35.2,30
  Bottom 0.305: v12.2,26.2 17.4,26.2 20.8,29.6 31,29.6 31.2,29.8 34.6,29.8 v35,30.2 36.2,31.4 TP4.TP
STATUS1
  Top 0.305: R6.1 7,29.4 7.6,28.8 7.6,28.2 8.2,27.6 10.63,27.6 U$3.10
STATUS2
  Top 0.305: R9.1 7,25 7.6,25.6 7.6,26.4 8.32,27.12 U$3.11
TEST  (via drill 0.4)
  Top 0.305: 6.7,36.3 6.2,35.8 6.2,35.2 5.65,34.65 X3.4 | 6.7,36.3 7.4,37 R35.1 | U$1.47 26.55,31.85 v27,31.4 | v6.6,36.4 6.7,36.3
  Bottom 0.305: v27,31.4 26.4,32 26,32 23.4,34.6 11.6,34.6 10,36.2 7.2,36.2 7,36.4 v6.6,36.4
TX  (via drill 0.4)
  Top 0.305: R7.2 18.4,34.8 18.8,35.2 v18.8,35.6 18.8,37.8 18,38.6 4.8,38.6 X3.1 | U$1.33 31.35,30.05 v30,31.4
  Bottom 0.305: v30,31.4 28.2,31.4 27,32.6 26.2,32.6 23.6,35.2 19.4,35.2 19,35.6 v18.8,35.6
USB_GPX  (via drill 0.4)
  Top 0.305: U$1.14 26.55,23.2 v26,23.2 | U$3.17 11.61,23.21 v11.4,23
  Bottom 0.305: v11.4,23 12.4,23 12.8,23.4 25.8,23.4 v26,23.2
USB_INT  (via drill 0.4)
  Top 0.305: U$3.18 12.56,22 11,22 v10.6,22.4 | U$1.15 27.05,22.4 v27,22.4
  Bottom 0.305: v27,22.4 25.8,22.4 25.4,22.8 13,22.8 12.2,22 11,22 v10.6,22.4
USB_RES  (via drill 0.4)
  Top 0.305: U$1.2 23.45,31.05 v23.2,30.8 | U$3.12 11.58,26.62 11.6,26.6 v12,27.2
  Bottom 0.305: v23.2,30.8 22.6,30.2 20.6,30.2 17.2,26.8 12.8,26.8 12.4,27.2 v12,27.2
VBUS  (via drill 0.4)
  Top 0.305: U$3.22 14.56,22.04 15.8,20.8 16.2,20.8 v16.6,20.6 | v9.2,17.6 9.35,17.45 C20.2
  Top 0.61: U$9.1 10.6,12.87 10.6,15.6 | 10.6,15.6 C20.2 | U$8.5 3.2,13.6 8.6,13.6 10.6,15.6
  Bottom 0.305: v16.6,20.6 11,20.6 9.2,18.8 v9.2,17.6
VBUS_EN  (via drill 0.4)
  Top 0.305: U$3.4 14.06,28.46 v13.8,28.2 | U$8.3 6.7,16.5 7.4,17.2 v7.4,18.8
  Bottom 0.305: v13.8,28.2 13.6,28 13.2,28 12.6,28.6 11.4,28.6 9.8,27 8.6,27 7.8,26.2 7.8,19.2 v7.4,18.8
VBUS_FLAG  (via drill 0.4)
  Top 0.305: U$3.1 15.56,27.6 v15.4,27.6 | U$8.4 2.9,16.5 3.6,17.2 6.6,17.2 6.8,17.4 6.8,18.4 6.6,18.6 6.6,19.2 7.2,19.8 v8.6,19.8
  Bottom 0.305: v8.6,19.8 8.4,20 8.4,26 8.8,26.4 10,26.4 11.6,28 12.4,28 13,27.4 15.2,27.4 v15.4,27.6
XT2IN
  Top 0.305: U$1.45 27.55,34.75 29.8,37 Y3.1 37.02,37 C2.2
XT2OUT
  Top 0.305: U$1.46 27.05,34.75 24.8,37 Y3.2 21.75,37 C5.2

### Text on the board
Top: 1
Bottom: 2
tmine: 3V3 | ext 5V | + | J1
bmine: debug | tp5 | tp4 | debug | tx[] | rx | vcc | test | rst | gnd | tp3 | tp6 | tp2 | tp7 | tp1 - gnd / tp2 - gnd / tp3 - mosi / tp4 - clk / tp5 - cs J1 / tp6 - cs usb / tp7 - miso | test points | 1-2 external 5V / 2-3 (def) midi 5V | github.com/rodan/lemidi | Petre Rodan 201901 rev 2 | tp1 | J1 jumper